# Altium schematic sheet ESP32_Schem_V2.SchDoc (part 1 of 4)
size A1; SheetNumber: 3; SheetTotal: 3
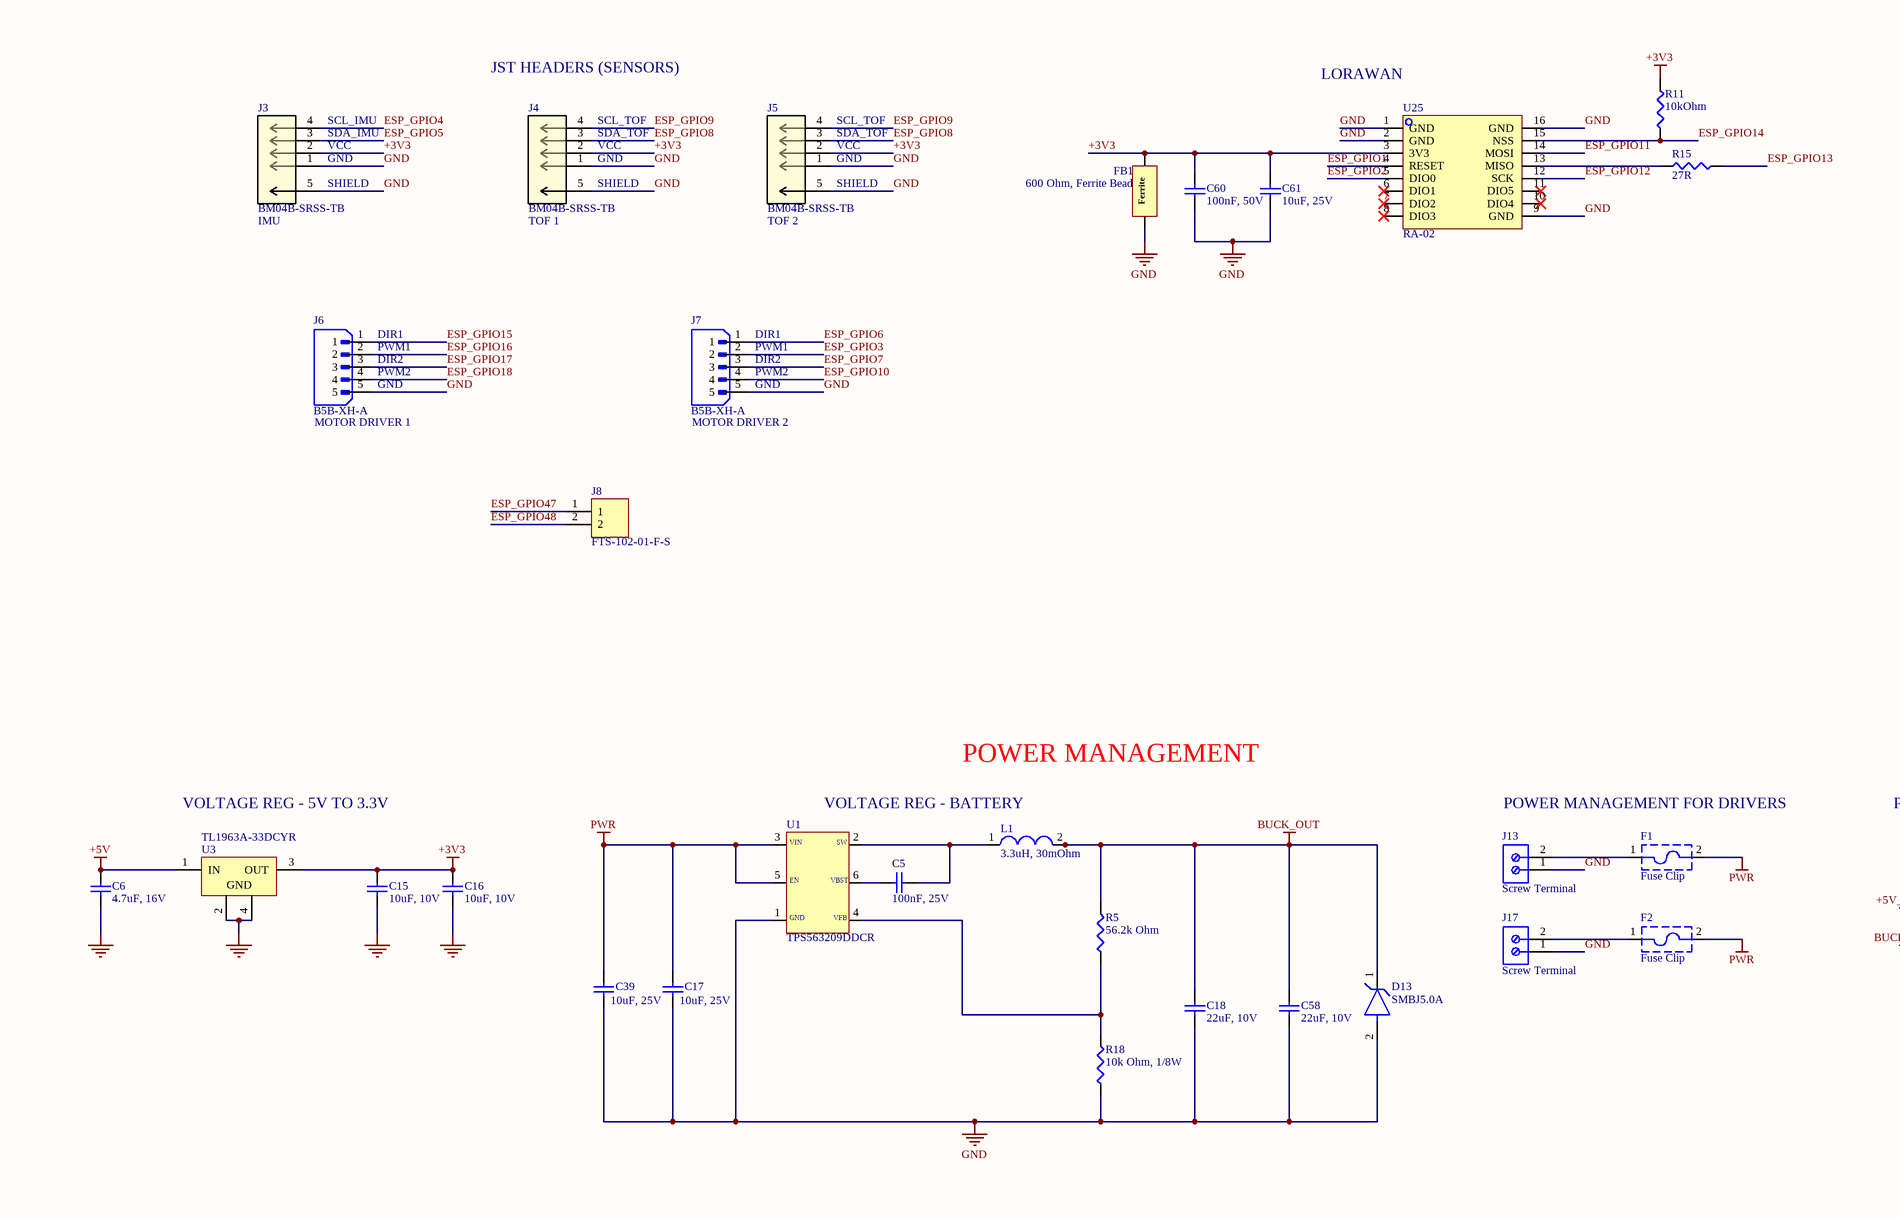
[diagram p0: ESP32_Schem_V2.SchDoc, top left]
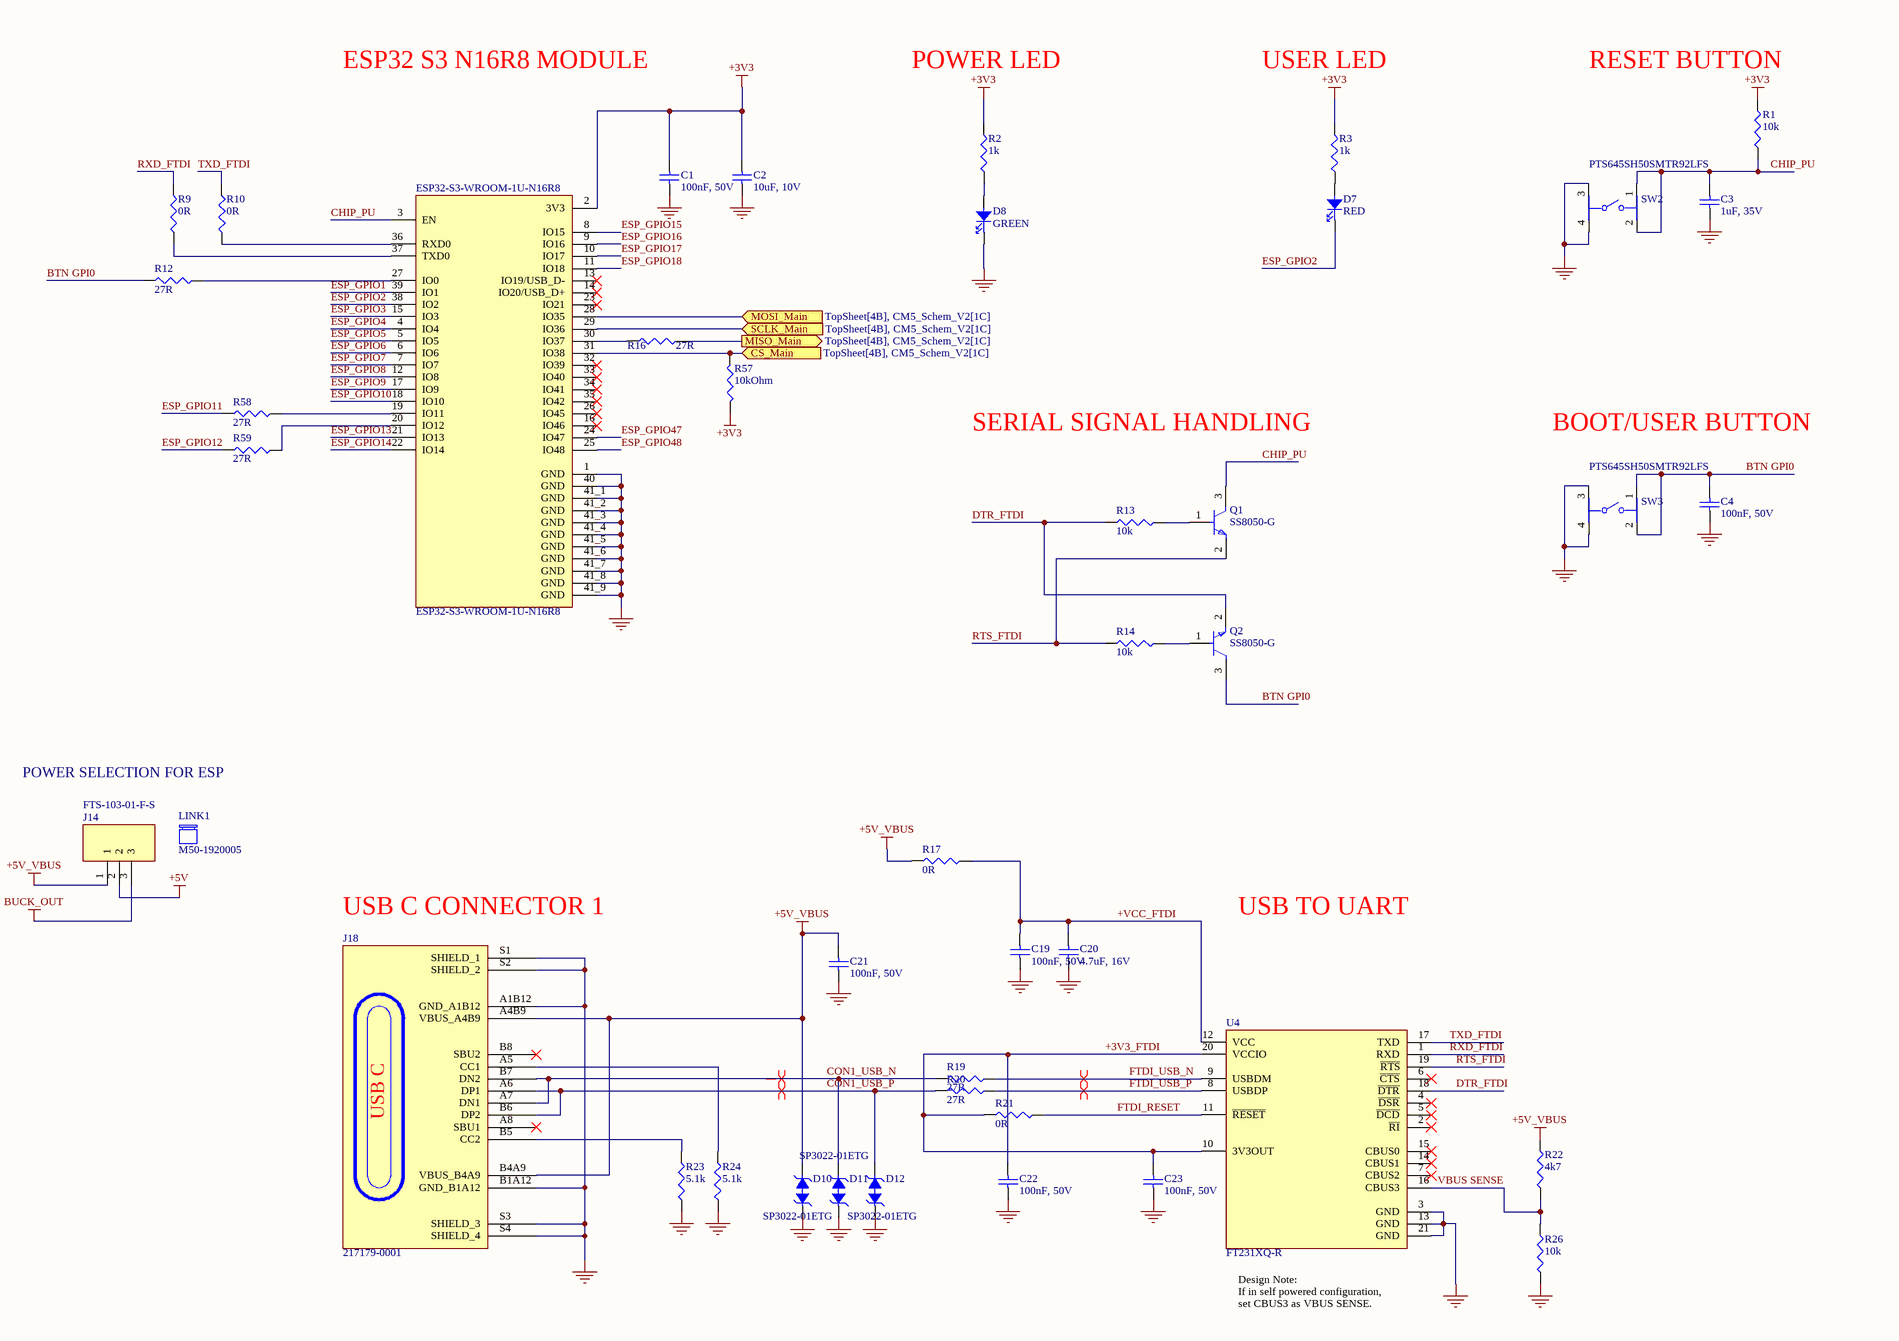
[diagram p1: ESP32_Schem_V2.SchDoc, top right]
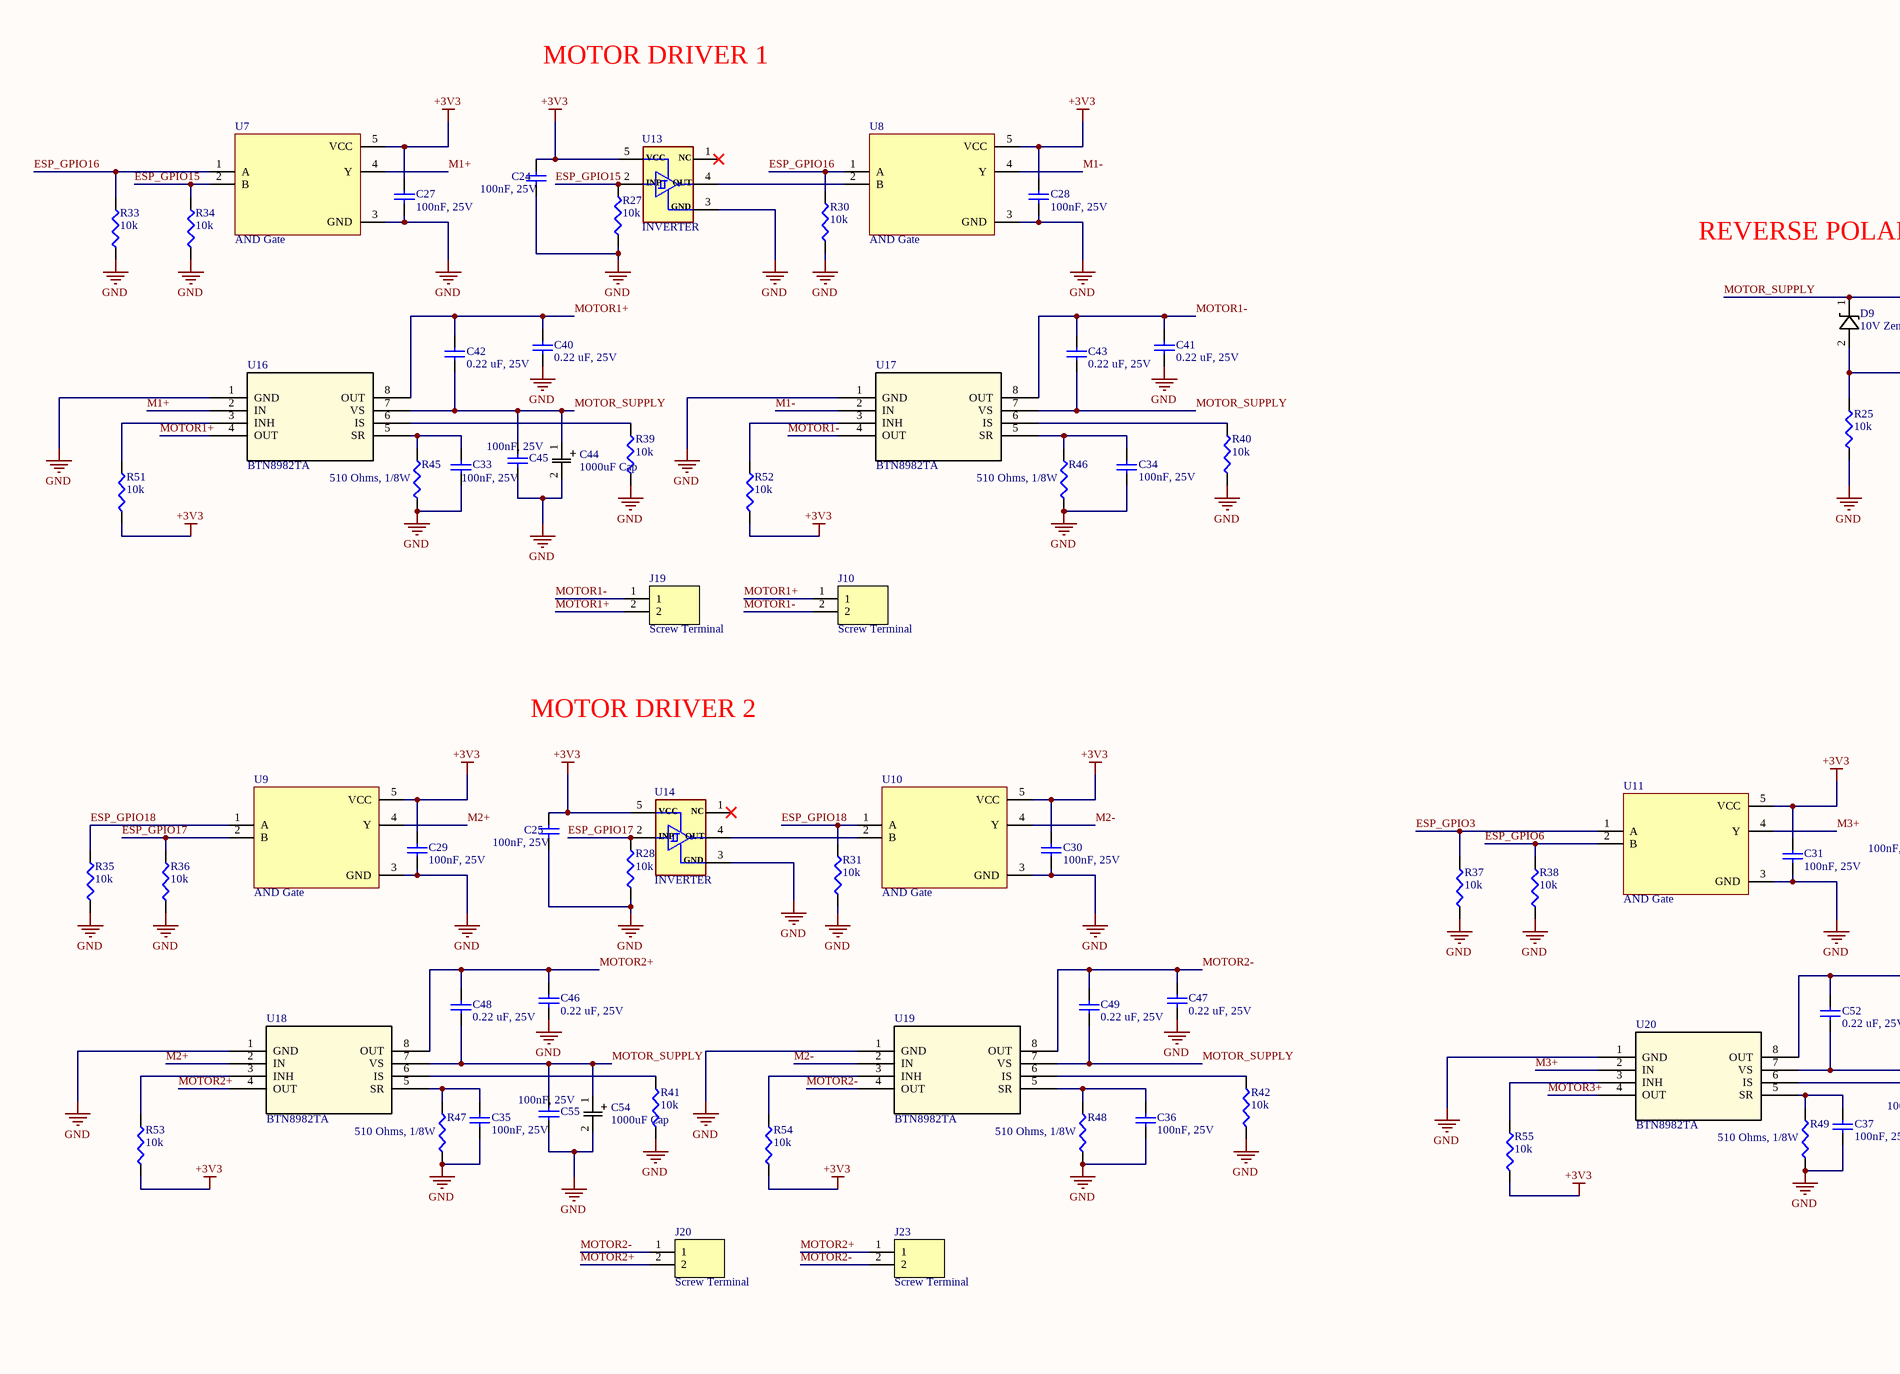
[diagram p2: ESP32_Schem_V2.SchDoc, bottom left]
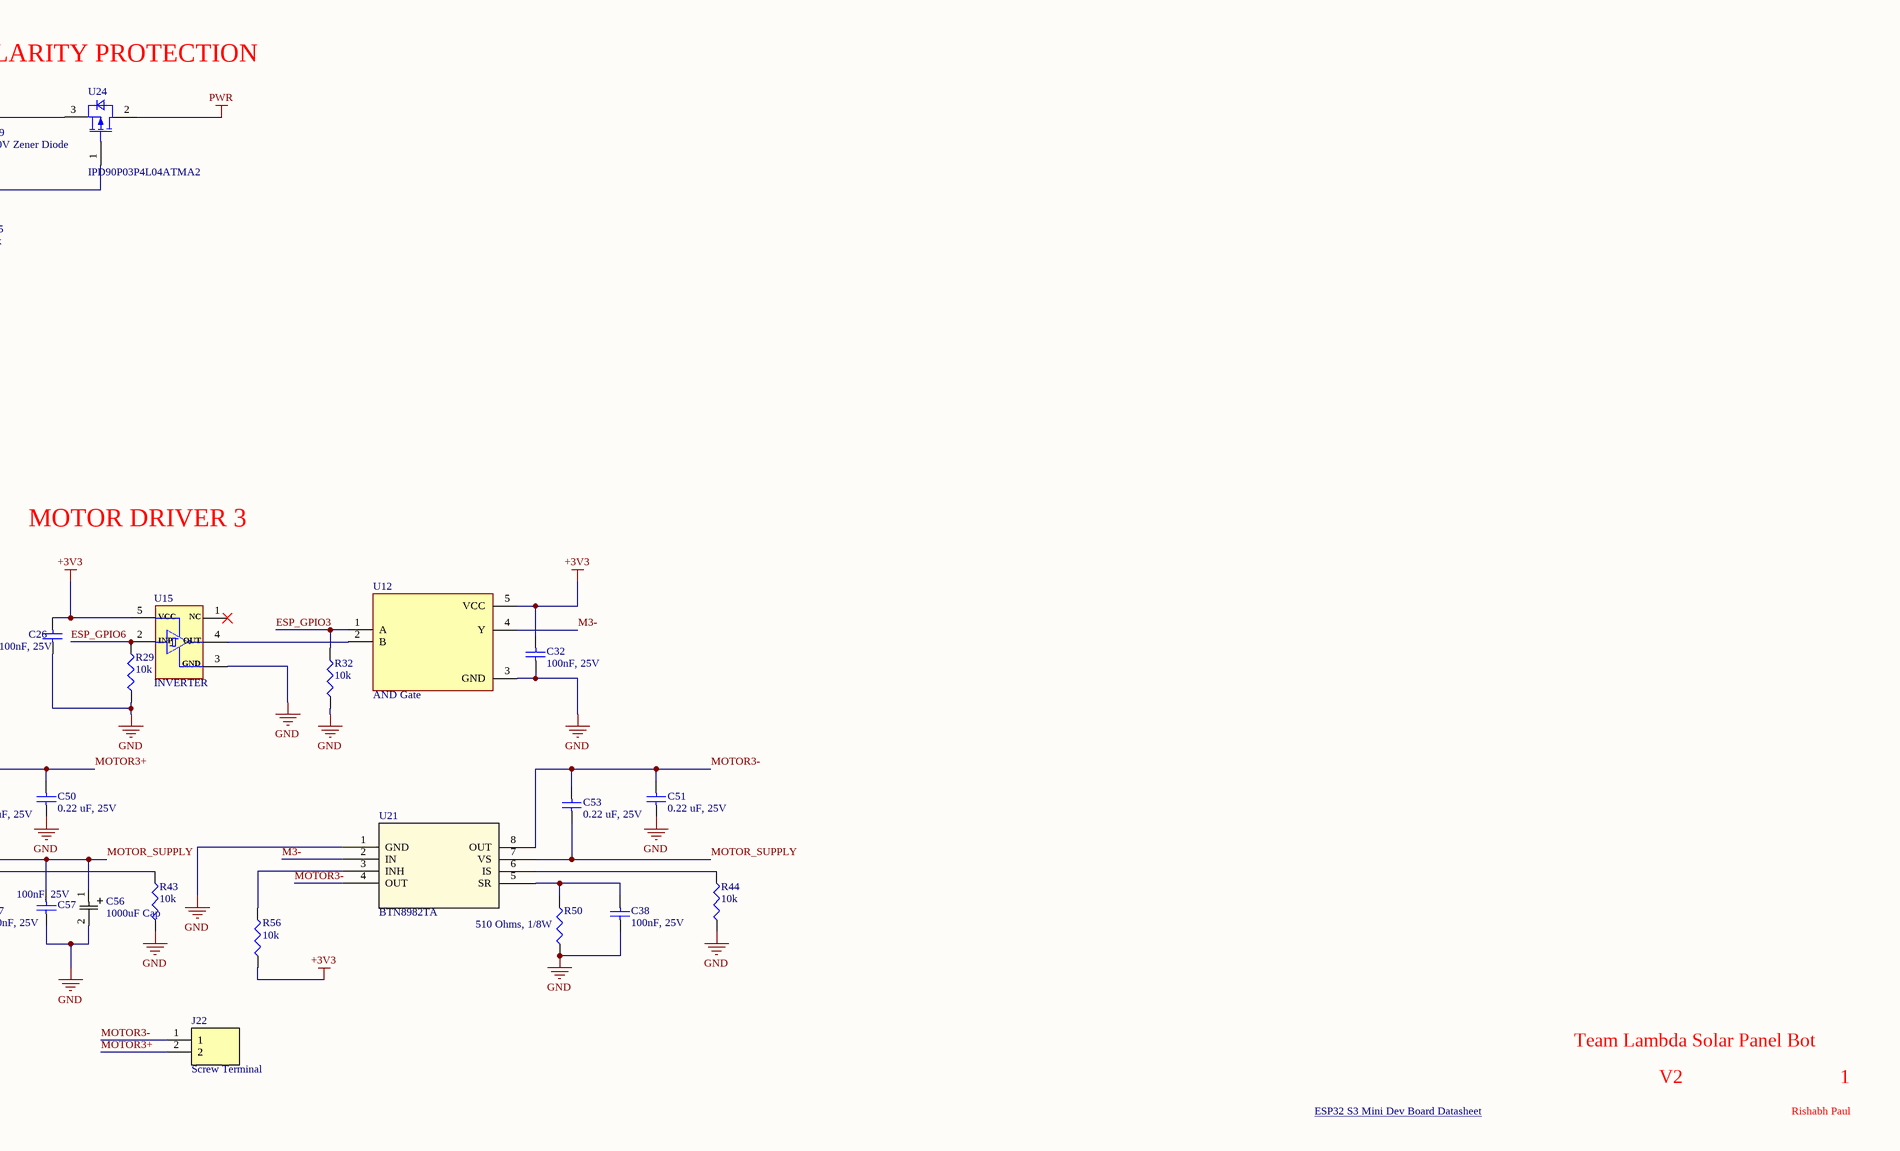
[diagram p3: ESP32_Schem_V2.SchDoc, bottom right]

## Parts
C1  100nF, 50V  [CAPC1005X55N]
C2  10uF, 10V  [CAPC1005X55N]
C3  1uF, 35V  [CAPC1005X55N]
C4  100nF, 50V  [CAPC1005X55N]
C5  100nF, 25V  [CAP_X7R_0805_AVX-M]
C6  4.7uF, 16V  [CAPC1005X55N]
C15  10uF, 10V  [CAPC1005X55N]
C16  10uF, 10V  [CAPC1005X55N]
C17  10uF, 25V  [CAPC2012X95N]
C18  22uF, 10V  [CAP_1608_TDK-M]
C19  100nF, 50V  [CAPC1005X55N]
C20  4.7uF, 16V  [CAPC1005X55N]
C21  100nF, 50V  [CAPC1005X55N]
C22  100nF, 50V  [CAPC1005X55N]
C23  100nF, 50V  [CAPC1005X55N]
C24  100nF, 25V  [CAP_X7R_0805_AVX-M]
C25  100nF, 25V  [CAP_X7R_0805_AVX-M]
C26  100nF, 25V  [CAP_X7R_0805_AVX-M]
C27  100nF, 25V  [CAP_X7R_0805_AVX-M]
C28  100nF, 25V  [CAP_X7R_0805_AVX-M]
C29  100nF, 25V  [CAP_X7R_0805_AVX-M]
C30  100nF, 25V  [CAP_X7R_0805_AVX-M]
C31  100nF, 25V  [CAP_X7R_0805_AVX-M]
C32  100nF, 25V  [CAP_X7R_0805_AVX-M]
C33  100nF, 25V  [CAP_X7R_0805_AVX-M]
C34  100nF, 25V  [CAP_X7R_0805_AVX-M]
C35  100nF, 25V  [CAP_X7R_0805_AVX-M]
C36  100nF, 25V  [CAP_X7R_0805_AVX-M]
C37  100nF, 25V  [CAP_X7R_0805_AVX-M]
C38  100nF, 25V  [CAP_X7R_0805_AVX-M]
C39  10uF, 25V  [CAPC2012X95N]
C40  0.22 uF, 25V  [CAP_1608_TDK-M]
C41  0.22 uF, 25V  [CAP_1608_TDK-M]
C42  0.22 uF, 25V  [CAP_1608_TDK-M]
C43  0.22 uF, 25V  [CAP_1608_TDK-M]
C44  1000uF Cap  [CAP_PKPZ_10X20_LOW_RUB]
C45  100nF, 25V  [CAP_X7R_0805_AVX-M]
C46  0.22 uF, 25V  [CAP_1608_TDK-M]
C47  0.22 uF, 25V  [CAP_1608_TDK-M]
C48  0.22 uF, 25V  [CAP_1608_TDK-M]
C49  0.22 uF, 25V  [CAP_1608_TDK-M]
C50  0.22 uF, 25V  [CAP_1608_TDK-M]
C51  0.22 uF, 25V  [CAP_1608_TDK-M]
C52  0.22 uF, 25V  [CAP_1608_TDK-M]
C53  0.22 uF, 25V  [CAP_1608_TDK-M]
C54  1000uF Cap  [CAP_PKPZ_10X20_LOW_RUB]
C55  100nF, 25V  [CAP_X7R_0805_AVX-M]
C56  1000uF Cap  [CAP_PKPZ_10X20_LOW_RUB]
C57  100nF, 25V  [CAP_X7R_0805_AVX-M]
C58  22uF, 10V  [CAP_1608_TDK-M]
C60  100nF, 50V  [CAPC1005X55N]
C61  10uF, 25V  [CAPC2012X95N]
D7  RED  [LED0402R]
D8  GREEN  [LED0402G]
D9  10V Zener Diode  [CR_BZT52_DIO]
D10  SP3022-01ETG  [SOD882]
D11  SP3022-01ETG  [SOD882]
D12  SP3022-01ETG  [SOD882]
D13  SMBJ5.0A  [DO-214AASMB_J-BEND_LTF-M]
ESP32-S3-WROOM-1U-N16R8  ESP32-S3-WROOM-1U-N16R8  [XCVR_ESP32-S3-WROOM-1U-N16R8]
F1  Fuse Clip  [696108003002]
F2  Fuse Clip  [696108003002]
FB1  600 Ohm, Ferrite Bead  [BEADC1608X95N]
J3  BM04B-SRSS-TB  [CONN4_BM04B-SRSS_JST]
J4  BM04B-SRSS-TB  [CONN4_BM04B-SRSS_JST]
J5  BM04B-SRSS-TB  [CONN4_BM04B-SRSS_JST]
J6  B5B-XH-A  [JST_B5B-XH-A]
J7  B5B-XH-A  [JST_B5B-XH-A]
J8  FTS-102-01-F-S  [HDR_1x2_1.27MM]
J10  Screw Terminal  [CUI_TB005-762-02BE]
J13  Screw Terminal  [PHOENIX_1725656]
J14  FTS-103-01-F-S  [HDR_1x3_1.27MM]
J17  Screw Terminal  [PHOENIX_1725656]
J18  217179-0001  [FP-2171790001-MFG]
J19  Screw Terminal  [CUI_TB005-762-02BE]
J20  Screw Terminal  [CUI_TB005-762-02BE]
J22  Screw Terminal  [CUI_TB005-762-02BE]
J23  Screw Terminal  [CUI_TB005-762-02BE]
L1  3.3uH, 30mOhm  [IND_VLS6045EX-3R3N]
LINK1  M50-1920005  (mechanical)
Q1  SS8050-G  [FP-SS8050-G-IPC_B]
Q2  SS8050-G  [FP-SS8050-G-IPC_B]
R1  10k  [RESC1005X37N]
R2  1k  [RESC1005X37N]
R3  1k  [RESC1005X37N]
R5  56.2k Ohm  [RESC0603X26N]
R9  0R  [RESC1005X37N]
R10  0R  [RESC1005X37N]
R11  10kOhm  [RESC0603X26N - duplicate]
R12  27R  [RESC1005X37N]
R13  10k  [RESC1005X37N]
R14  10k  [RESC1005X37N]
R15  27R  [RESC1005X37N]
R16  27R  [RESC1005X37N]
R17  0R  [RESC1005X37N]
R18  10k Ohm, 1/8W  [RESC1005X40N]
R19  27R  [RESC1005X37N]
R20  27R  [RESC1005X37N]
R21  0R  [RESC1005X37N]
R22  4k7  [RESC1005X37N]
R23  5.1k  [RESC1005X37N]
R24  5.1k  [RESC1005X37N]
R25  10k  [RESC1005X40N]
R26  10k  [RESC1005X37N]
R27  10k  [RESC1005X40N]
R28  10k  [RESC1005X40N]
R29  10k  [RESC1005X40N]
R30  10k  [RESC1005X40N]
R31  10k  [RESC1005X40N]
R32  10k  [RESC1005X40N]
R33  10k  [RESC1005X40N]
R34  10k  [RESC1005X40N]
R35  10k  [RESC1005X40N]
R36  10k  [RESC1005X40N]
R37  10k  [RESC1005X40N]
R38  10k  [RESC1005X40N]
R39  10k  [RESC1005X40N]
R40  10k  [RESC1005X40N]
R41  10k  [RESC1005X40N]
R42  10k  [RESC1005X40N]
R43  10k  [RESC1005X40N]
R44  10k  [RESC1005X40N]
R45  510 Ohms, 1/8W  [RESC2012X60N]
R46  510 Ohms, 1/8W  [RESC2012X60N]
R47  510 Ohms, 1/8W  [RESC2012X60N]
R48  510 Ohms, 1/8W  [RESC2012X60N]
R49  510 Ohms, 1/8W  [RESC2012X60N]
R50  510 Ohms, 1/8W  [RESC2012X60N]
R51  10k  [RESC1005X40N]
R52  10k  [RESC1005X40N]
R53  10k  [RESC1005X40N]
R54  10k  [RESC1005X40N]
R55  10k  [RESC1005X40N]
R56  10k  [RESC1005X40N]
R57  10kOhm  [RESC0603X26N - duplicate]
R58  27R  [RESC1005X37N]
R59  27R  [RESC1005X37N]
SW2  PTS645SH50SMTR92LFS  [FP-PTS645SH50SMTR92LFS-MFG]
SW3  PTS645SH50SMTR92LFS  [FP-PTS645SH50SMTR92LFS-MFG]
U1  TPS563209DDCR  [DDC0006A]
U3  TL1963A-33DCYR  [DCY0004A_N]
U4  FT231XQ-R  [FP-QFN-20-IPC_B]
U7  AND Gate  [SOT95P280X145-5N]
U8  AND Gate  [SOT95P280X145-5N]
U9  AND Gate  [SOT95P280X145-5N]
U10  AND Gate  [SOT95P280X145-5N]
U11  AND Gate  [SOT95P280X145-5N]
U12  AND Gate  [SOT95P280X145-5N]
U13  INVERTER  [SOT95P280X145-5N]
U14  INVERTER  [SOT95P280X145-5N]
U15  INVERTER  [SOT95P280X145-5N]
U16  BTN8982TA  [IC8_BTN8982TAAUMA1_INF]
U17  BTN8982TA  [IC8_BTN8982TAAUMA1_INF]
U18  BTN8982TA  [IC8_BTN8982TAAUMA1_INF]
U19  BTN8982TA  [IC8_BTN8982TAAUMA1_INF]
U20  BTN8982TA  [IC8_BTN8982TAAUMA1_INF]
U21  BTN8982TA  [IC8_BTN8982TAAUMA1_INF]
U24  IPD90P03P4L04ATMA2  [TO228P998X235-3N-2-V]
U25  RA-02  [MODULE_RA-02_LORA]

## Ports
CS_Main (in, see TopSheet[4B], CM5_Schem_V2[1C]), MISO_Main (out, see TopSheet[4B], CM5_Schem_V2[1C]), MOSI_Main (in, see TopSheet[4B], CM5_Schem_V2[1C]), SCLK_Main (in, see TopSheet[4B], CM5_Schem_V2[1C])

## Nets
+3V3: C1.2 C2.2 C15.2 C16.2 C24.2 C25.2 C26.2 C27.2 C28.2 C29.2 C30.2 C31.2 C32.2 C60.2 C61.2 ESP32-S3-WROOM-1U-N16R8.2(3V3) FB1.2 J3.2 J4.2 J5.2 R1.2 R2.2 R3.2 R11.2 R51.1 R52.1 R53.1 R54.1 R55.1 R56.1 R57.2 U3.3(OUT) U7.5(VCC) U8.5(VCC) U9.5(VCC) U10.5(VCC) U11.5(VCC) U12.5(VCC) U13.5(VCC) U14.5(VCC) U15.5(VCC) U25.3(3V3)
+5V: C6.2 J14.2 U3.1(IN)
+5V_VBUS: C21.2 D10.2 J14.1 J18.A4B9(VBUS_A4B9) J18.B4A9(VBUS_B4A9) R17.1 R22.2
BUCK_OUT: C18.1 C58.1 D13.1 J14.3 L1.2 R5.2
GND: C1.1 C2.1 C3.1 C4.1 C6.1 C15.1 C16.1 C17.1 C18.2 C19.1 C20.1 C21.1 C22.1 C23.1 C24.1 C25.1 C26.1 C27.1 C28.1 C29.1 C30.1 C31.1 C32.1 C33.1 C34.1 C35.1 C36.1 C37.1 C38.1 C39.1 C40.1 C41.1 C44.2 C45.1 C46.1 C47.1 C50.1 C51.1 C54.2 C55.1 C56.2 C57.1 C58.2 C60.1 C61.1 D8.1 D10.1 D11.1 D12.1 D13.2 ESP32-S3-WROOM-1U-N16R8.1(GND) ESP32-S3-WROOM-1U-N16R8.40(GND) ESP32-S3-WROOM-1U-N16R8.41_1(GND) ESP32-S3-WROOM-1U-N16R8.41_2(GND) ESP32-S3-WROOM-1U-N16R8.41_3(GND) ESP32-S3-WROOM-1U-N16R8.41_4(GND) ESP32-S3-WROOM-1U-N16R8.41_5(GND) ESP32-S3-WROOM-1U-N16R8.41_6(GND) ESP32-S3-WROOM-1U-N16R8.41_7(GND) ESP32-S3-WROOM-1U-N16R8.41_8(GND) ESP32-S3-WROOM-1U-N16R8.41_9(GND) FB1.1 J3.1 J3.5 J4.1 J4.5 J5.1 J5.5 J6.5 J7.5 J13.1 J17.1 J18.A1B12(GND_A1B12) J18.B1A12(GND_B1A12) J18.S1(SHIELD_1) J18.S2(SHIELD_2) J18.S3(SHIELD_3) J18.S4(SHIELD_4) R18.1 R23.1 R24.1 R25.1 R26.1 R27.1 R28.1 R29.1 R30.1 R31.1 R32.1 R33.1 R34.1 R35.1 R36.1 R37.1 R38.1 R39.1 R40.1 R41.1 R42.1 R43.1 R44.1 R45.1 R46.1 R47.1 R48.1 R49.1 R50.1 SW2.3 SW2.4 SW3.3 SW3.4 U1.1 U3.2(GND) U3.4(GND) U4.3(GND) U4.13(GND) U4.21(GND) U7.3(GND) U8.3(GND) U9.3(GND) U10.3(GND) U11.3(GND) U12.3(GND) U13.3(GND) U14.3(GND) U15.3(GND) U16.1(GND) U17.1(GND) U18.1(GND) U19.1(GND) U20.1(GND) U21.1(GND) U25.1(GND) U25.2(GND) U25.9(GND) U25.16(GND)
PWR: C17.2 C39.2 F1.2 F2.2 U1.3 U1.5 U24.2(DRAIN)
+3V3_FTDI: C22.2 C23.2 R21.1 U4.10(3V3OUT) U4.20(VCCIO)
+VCC_FTDI: C19.2 C20.2 R17.2 U4.12(VCC)
BTN GPI0: C4.2 Q2.3(C) R12.2 SW3.1 SW3.2
CHIP_PU: C3.2 ESP32-S3-WROOM-1U-N16R8.3(EN) Q1.3(C) R1.1 SW2.1 SW2.2
CON1_USB_N: D11.2 J18.A7(DN1) J18.B7(DN2) R19.2
CON1_USB_P: D12.2 J18.A6(DP1) J18.B6(DP2) R20.2
CS_Main: ESP32-S3-WROOM-1U-N16R8.31(IO38) R57.1 ; port CS_Main
DTR_FTDI: Q2.2(E) R13.2 U4.18(~{DTR})
ESP_GPIO1: ESP32-S3-WROOM-1U-N16R8.39(IO1) U25.4(RESET)
ESP_GPIO2: D7.1 ESP32-S3-WROOM-1U-N16R8.38(IO2) U25.5(DIO0)
ESP_GPIO3: ESP32-S3-WROOM-1U-N16R8.15(IO3) J7.2 R32.2 R37.2 U11.1(A) U12.1(A)
ESP_GPIO4: ESP32-S3-WROOM-1U-N16R8.4(IO4) J3.4
ESP_GPIO5: ESP32-S3-WROOM-1U-N16R8.5(IO5) J3.3
ESP_GPIO6: ESP32-S3-WROOM-1U-N16R8.6(IO6) J7.1 R29.2 R38.2 U11.2(B) U15.2(A)
ESP_GPIO7: ESP32-S3-WROOM-1U-N16R8.7(IO7) J7.3
ESP_GPIO8: ESP32-S3-WROOM-1U-N16R8.12(IO8) J4.3 J5.3
ESP_GPIO9: ESP32-S3-WROOM-1U-N16R8.17(IO9) J4.4 J5.4
ESP_GPIO10: ESP32-S3-WROOM-1U-N16R8.18(IO10) J7.4
ESP_GPIO11: R58.1 U25.14(MOSI)
ESP_GPIO12: R59.1 U25.12(SCK)
ESP_GPIO13: ESP32-S3-WROOM-1U-N16R8.21(IO13) R15.2
ESP_GPIO14: ESP32-S3-WROOM-1U-N16R8.22(IO14) R11.1 U25.15(NSS)
ESP_GPIO15: ESP32-S3-WROOM-1U-N16R8.8(IO15) J6.1 R27.2 R34.2 U7.2(B) U13.2(A)
ESP_GPIO16: ESP32-S3-WROOM-1U-N16R8.9(IO16) J6.2 R30.2 R33.2 U7.1(A) U8.1(A)
ESP_GPIO17: ESP32-S3-WROOM-1U-N16R8.10(IO17) J6.3 R28.2 R36.2 U9.2(B) U14.2(A)
ESP_GPIO18: ESP32-S3-WROOM-1U-N16R8.11(IO18) J6.4 R31.2 R35.2 U9.1(A) U10.1(A)
ESP_GPIO47: ESP32-S3-WROOM-1U-N16R8.24(IO47) J8.1
ESP_GPIO48: ESP32-S3-WROOM-1U-N16R8.25(IO48) J8.2
FTDI_RESET: R21.2 U4.11(~{RESET})
FTDI_USB_N: R19.1 U4.9(USBDM)
FTDI_USB_P: R20.1 U4.8(USBDP)
M1+: U7.4(Y) U16.2(IN)
M1-: U8.4(Y) U17.2(IN)
M2+: U9.4(Y) U18.2(IN)
M2-: U10.4(Y) U19.2(IN)
M3+: U11.4(Y) U20.2(IN)
M3-: U12.4(Y) U21.2(IN)
MISO_Main: R16.2 ; port MISO_Main
MOSI_Main: ESP32-S3-WROOM-1U-N16R8.28(IO35) ; port MOSI_Main
MOTOR1+: C40.2 C42.2 J10.1 J19.2 U16.4(OUT) U16.8(OUT)
MOTOR1-: C41.2 C43.2 J10.2 J19.1 U17.4(OUT) U17.8(OUT)
MOTOR2+: C46.2 C48.2 J20.2 J23.1 U18.4(OUT) U18.8(OUT)
MOTOR2-: C47.2 C49.2 J20.1 J23.2 U19.4(OUT) U19.8(OUT)
MOTOR3+: C50.2 C52.2 J22.2 U20.4(OUT) U20.8(OUT)
MOTOR3-: C51.2 C53.2 J22.1 U21.4(OUT) U21.8(OUT)
MOTOR_SUPPLY: C42.1 C43.1 C44.1 C45.2 C48.1 C49.1 C52.1 C53.1 C54.1 C55.2 C56.1 C57.2 D9.1(CATHODE) U16.7(VS) U17.7(VS) U18.7(VS) U19.7(VS) U20.7(VS) U21.7(VS) U24.3(SOURCE)
RTS_FTDI: Q1.2(E) R14.2 U4.19(~{RTS})
RXD_FTDI: R9.2 U4.1(RXD)
SCLK_Main: ESP32-S3-WROOM-1U-N16R8.29(IO36) ; port SCLK_Main
TXD_FTDI: R10.1 U4.17(TXD)
VBUS SENSE: R22.1 R26.2 U4.16(CBUS3)
NetC5_1: C5.1 U1.6
NetC5_2: C5.2 L1.1 U1.2
NetC33_2: C33.2 R45.2 U16.5(SR)
NetC34_2: C34.2 R46.2 U17.5(SR)
NetC35_2: C35.2 R47.2 U18.5(SR)
NetC36_2: C36.2 R48.2 U19.5(SR)
NetC37_2: C37.2 R49.2 U20.5(SR)
NetC38_2: C38.2 R50.2 U21.5(SR)
NetD7_2: D7.2 R3.1
NetD8_2: D8.2 R2.1
NetD9_2: D9.2(ANODE) R25.2 U24.1(GATE)
NetESP32-S3-WROOM-1U-N16R8_19: ESP32-S3-WROOM-1U-N16R8.19(IO11) R58.2
NetESP32-S3-WROOM-1U-N16R8_20: ESP32-S3-WROOM-1U-N16R8.20(IO12) R59.2
NetESP32-S3-WROOM-1U-N16R8_27: ESP32-S3-WROOM-1U-N16R8.27(IO0) R12.1
NetESP32-S3-WROOM-1U-N16R8_30: ESP32-S3-WROOM-1U-N16R8.30(IO37) R16.1
NetESP32-S3-WROOM-1U-N16R8_36: ESP32-S3-WROOM-1U-N16R8.36(RXD0) R10.2
NetESP32-S3-WROOM-1U-N16R8_37: ESP32-S3-WROOM-1U-N16R8.37(TXD0) R9.1
NetF1_1: F1.1 J13.2
NetF2_1: F2.1 J17.2
NetJ18_A5: J18.A5(CC1) R24.2
NetJ18_B5: J18.B5(CC2) R23.2
NetQ1_1: Q1.1(B) R13.1
NetQ2_1: Q2.1(B) R14.1
NetR5_1: R5.1 R18.2 U1.4
NetR15_1: R15.1 U25.13(MISO)
NetR39_2: R39.2 U16.6(IS)
NetR40_2: R40.2 U17.6(IS)
NetR41_2: R41.2 U18.6(IS)
NetR42_2: R42.2 U19.6(IS)
NetR43_2: R43.2 U20.6(IS)
NetR44_2: R44.2 U21.6(IS)
NetR51_2: R51.2 U16.3(INH)
NetR52_2: R52.2 U17.3(INH)
NetR53_2: R53.2 U18.3(INH)
NetR54_2: R54.2 U19.3(INH)
NetR55_2: R55.2 U20.3(INH)
NetR56_2: R56.2 U21.3(INH)
NetU8_2: U8.2(B) U13.4(Y)
NetU10_2: U10.2(B) U14.4(Y)
NetU12_2: U12.2(B) U15.4(Y)

Not connected (* = marked no-connect by the designer): ESP32-S3-WROOM-1U-N16R8 13(IO19/USB_D-)* 14(IO20/USB_D+)* 16(IO46)* 23(IO21)* 26(IO45)* 32(IO39)* 33(IO40)* 34(IO41)* 35(IO42)*; J18 A8(SBU1)* B8(SBU2)*; U4 2(~{RI})* 4(~{DSR})* 5(~{DCD})* 6(~{CTS})* 7(CBUS2)* 14(CBUS1)* 15(CBUS0)*; U13 1(NC)*; U14 1(NC)*; U15 1(NC)*; U25 6(DIO1)* 7(DIO2)* 8(DIO3)* 10(DIO4)* 11(DIO5)*

## Layout directives
differential pair; differential pair class DIFF90: CON1_USB_N, CON1_USB_P, FTDI_USB_N, FTDI_USB_P

## Notes on the sheet
- JST HEADERS (SENSORS)
- LORAWAN
- ESP32 S3 N16R8 MODULE
- POWER LED
- USER LED
- (near R1) RESET BUTTON
- (near J3) SCL_IMU
- (near J3) SDA_IMU
- (near J3) VCC
- (near J3) GND
- (near J4) SCL_TOF
- (near J4) SDA_TOF
- (near J4) VCC
- (near J4) GND
- (near J5) SCL_TOF
- (near J5) SDA_TOF
- (near J5) VCC
- (near J5) GND
- (near J3) IMU
- (near J3) SHIELD
- (near J4) TOF 1
- (near J4) SHIELD
- (near J5) TOF 2
- (near J5) SHIELD
- (near J6) DIR1
- (near J6) PWM1
- (near J7) DIR1
- (near J7) PWM1
- (near J6) DIR2
- (near J6) PWM2
- (near J6) GND
- (near J7) DIR2
- (near J7) PWM2
- (near J7) GND
- (near J6) MOTOR DRIVER 1
- (near J7) MOTOR DRIVER 2
- SERIAL SIGNAL HANDLING
- BOOT/USER BUTTON
- POWER MANAGEMENT
- VOLTAGE REG - 5V TO 3.3V
- VOLTAGE REG - BATTERY
- POWER MANAGEMENT FOR DRIVERS
- (near LINK1) POWER SELECTION FOR ESP
- (near J18) USB C CONNECTOR 1
- USB TO UART
- MOTOR DRIVER 1
- (near U4) Design Note:
  If in self powered configuration, set CBUS3 as VBUS SENSE.
- REVERSE POLARITY PROTECTION
- MOTOR DRIVER 2
- MOTOR DRIVER 3
- Team Lambda Solar Panel Bot
- ESP32 S3 Mini Dev Board Datasheet <https://www.espressif.com/sites/default/files/documentation/esp32-s3_datasheet_en.pdf>
- V2
- Rishabh Paul
- 1
- (in symbol 35PX1000MEFC10X20) +
- (in symbol 217179-0001) USB C
- (in symbol SN74AHC1G14DBVR) INP; OUT
- (in symbol TPS563209DDCR) VIN; SW; EN; VBST; GND; VFB